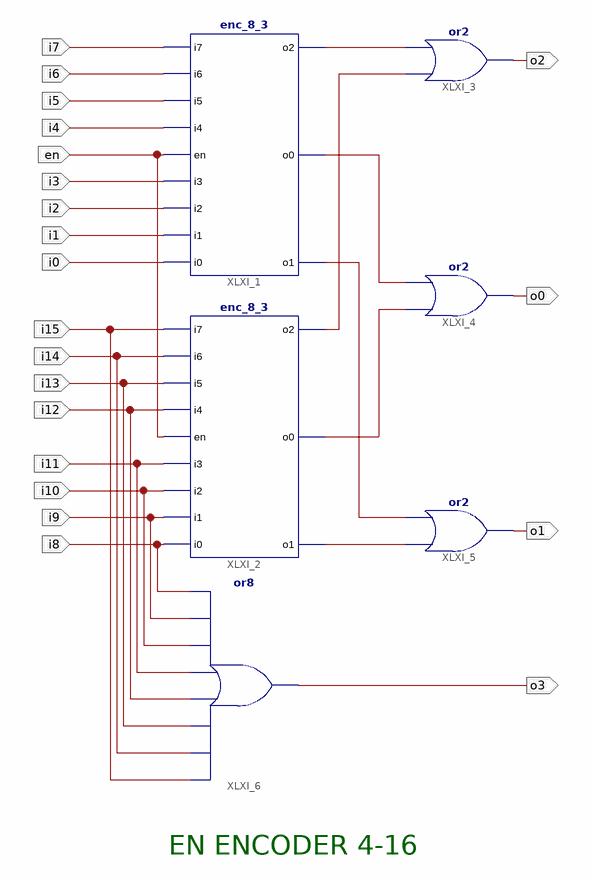
[diagram p0: schematic sheet 1]
// Xilinx ISE schematic enc_16_4.sch (spartan3e) as structural Verilog: 6 symbols, 21 ports
module enc_16_4 (
  input  i7,
  input  i6,
  input  i5,
  input  i4,
  input  i3,
  input  i2,
  input  i1,
  input  i0,
  input  i15,
  input  i14,
  input  i13,
  input  i12,
  input  i11,
  input  i10,
  input  i9,
  input  en,
  input  i8,
  output o2,
  output o0,
  output o1,
  output o3
);

  wire XLXN_27, XLXN_28, XLXN_29, XLXN_30, XLXN_31, XLXN_32;

  enc_8_3 XLXI_1 (
    .i7(i7), .i6(i6), .i5(i5), .i4(i4), .en(en), .i3(i3), .i2(i2), .i1(i1), .i0(i0), .o2(XLXN_28),
    .o0(XLXN_32), .o1(XLXN_30));
  enc_8_3 XLXI_2 (
    .i7(i15), .i6(i14), .i5(i13), .i4(i12), .en(en), .i3(i11), .i2(i10), .i1(i9), .i0(i8), .o2(XLXN_29),
    .o0(XLXN_31), .o1(XLXN_27));
  or XLXI_3 (o2, XLXN_29, XLXN_28);
  or XLXI_4 (o0, XLXN_31, XLXN_32);
  or XLXI_5 (o1, XLXN_27, XLXN_30);
  or XLXI_6 (o3, i15, i14, i13, i12, i11, i10, i9, i8);

  // Notes on the sheet:
  //   EN ENCODER 4-16
endmodule
